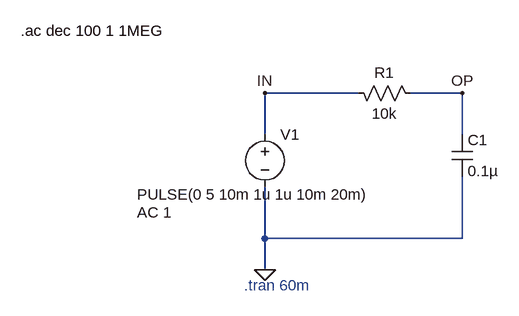
[diagram p0: schematic Draft1.asc]
Draft1.asc, the LTspice schematic file:
Version 4.1
SHEET 1 880 680
WIRE 160 48 16 48
WIRE 320 48 240 48
WIRE 16 112 16 48
WIRE 320 112 320 48
WIRE 16 272 16 192
WIRE 320 272 320 176
WIRE 320 272 16 272
WIRE 16 320 16 272
FLAG 16 320 0
FLAG 16 48 IN
FLAG 320 48 OP
SYMBOL voltage 16 96 R0
WINDOW 123 -197 136 Left 2
WINDOW 39 0 0 Left 0
WINDOW 3 -197 108 Left 2
SYMATTR Value2 AC 1
SYMATTR InstName V1
SYMATTR Value PULSE(0 5 10m 1u 1u 10m 20m)
SYMBOL cap 304 112 R0
SYMATTR InstName C1
SYMATTR Value 0.1µ
SYMBOL res 144 32 M90
WINDOW 0 0 56 VBottom 2
WINDOW 3 32 56 VTop 2
SYMATTR InstName R1
SYMATTR Value 10k
TEXT -16 344 Left 2 ;.tran 60m
TEXT -360 -48 Left 2 !.ac dec 100 1 1MEG

The netlist it stands for:
* Draft1.asc
V1 IN 0 PULSE(0 5 10m 1u 1u 10m 20m) AC 1
C1 OP 0 0.1µ
R1 IN OP 10k
* .tran 60m
.ac dec 100 1 1MEG
.backanno
.end

* Results of the author's LTspice run, read from the files saved beside the schematic
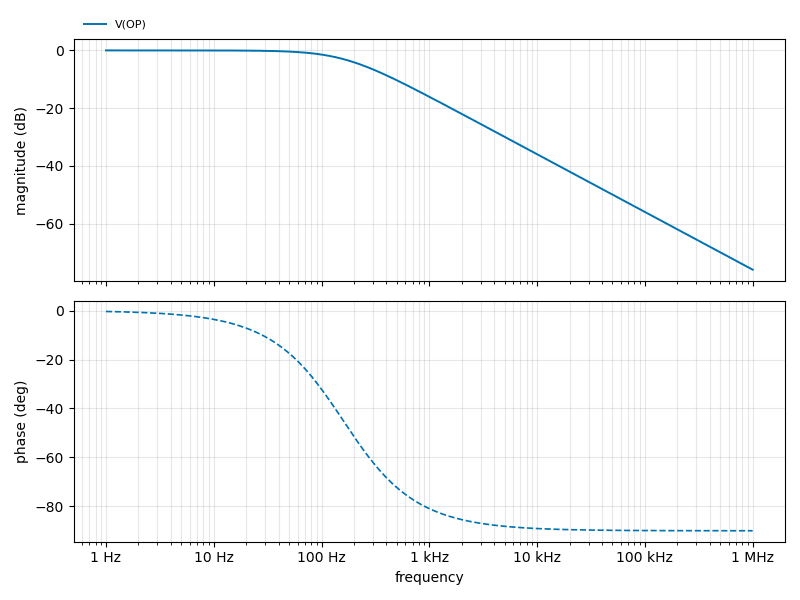
[diagram p1: AC Analysis of Draft1.asc, plotted from the saved traces]
* AC Analysis, 1 run:
*   V(OP): -0.00 dB at 1 Hz, -75.96 dB at 1 MHz, peak -0.00 dB at 1 Hz, 3 dB below the peak at 159.2 Hz